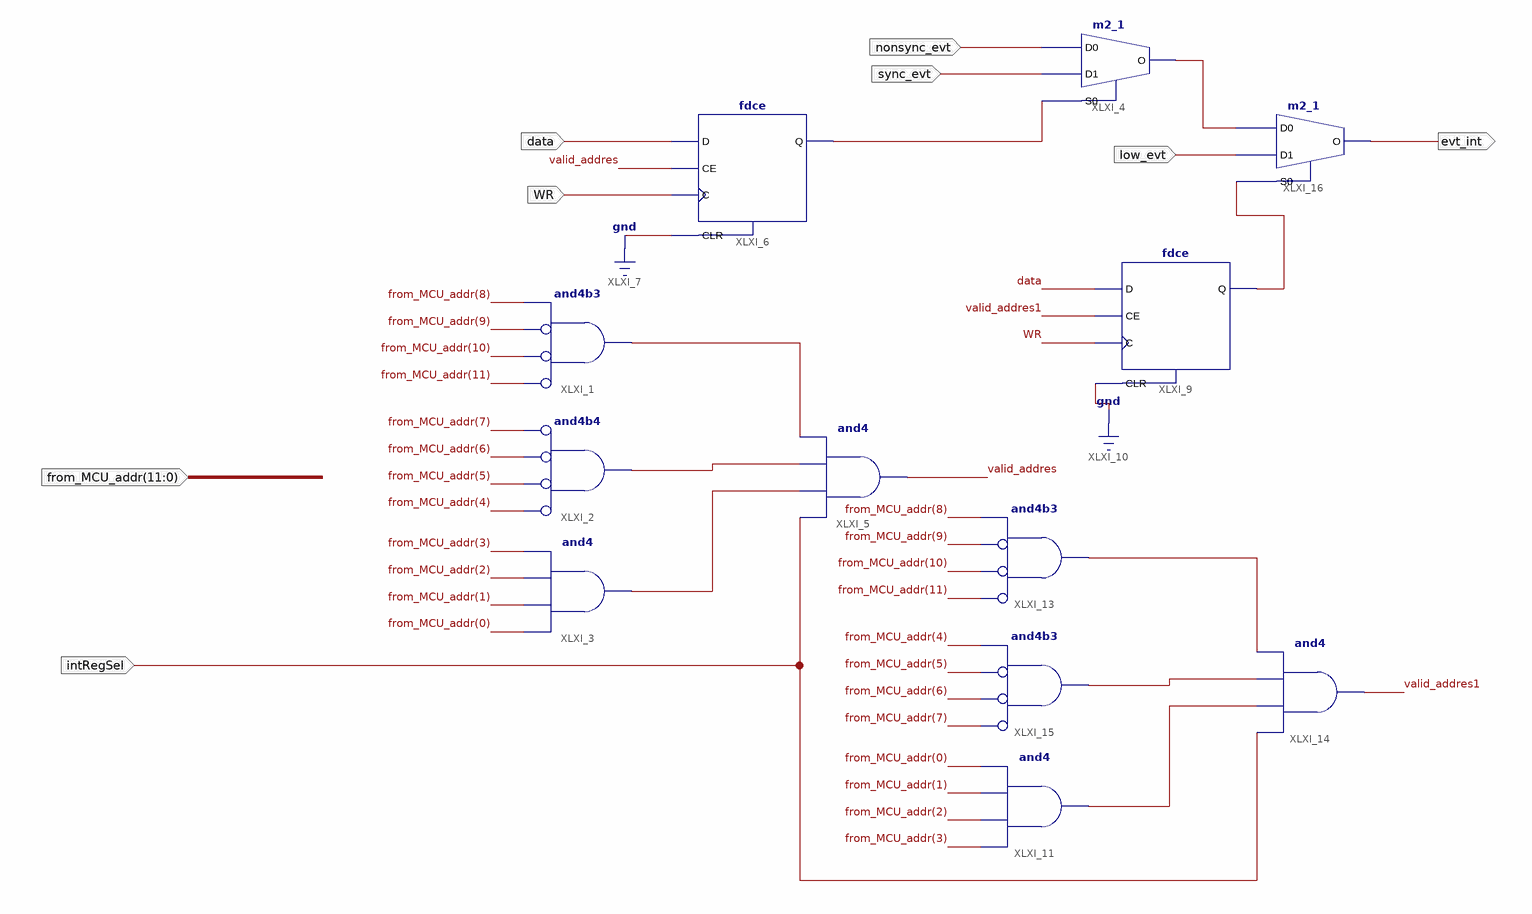
[diagram p0: schematic sheet 1]
// Xilinx ISE schematic event_control.sch (spartan6) as structural Verilog: 12 symbols, 8 ports
module event_control (
  input  nonsync_evt,
  input  sync_evt,
  input  [11:0] from_MCU_addr,
  input  WR,
  input  intRegSel,
  input  data,
  input  low_evt,
  output evt_int
);

  wire valid_addres, valid_addres1, XLXN_14, XLXN_15, XLXN_16, XLXN_21, XLXN_45, XLXN_46, XLXN_47, XLXN_53,
       XLXN_56;

  and XLXI_1 (XLXN_14, ~from_MCU_addr[11], ~from_MCU_addr[10], ~from_MCU_addr[9], from_MCU_addr[8]);  // and4b3
  and XLXI_2 (XLXN_15, ~from_MCU_addr[4], ~from_MCU_addr[5], ~from_MCU_addr[6], ~from_MCU_addr[7]);  // and4b4
  and XLXI_3 (XLXN_16, from_MCU_addr[0], from_MCU_addr[1], from_MCU_addr[2], from_MCU_addr[3]);
  m2_1 XLXI_4 (.D0(nonsync_evt), .D1(sync_evt), .S0(XLXN_21), .O(XLXN_56));
  and XLXI_5 (valid_addres, intRegSel, XLXN_16, XLXN_15, XLXN_14);
  fdce XLXI_6 (.C(WR), .CE(valid_addres), .CLR(1'b0), .D(data), .Q(XLXN_21));
  fdce XLXI_9 (.C(WR), .CE(valid_addres1), .CLR(1'b0), .D(data), .Q(XLXN_53));
  and XLXI_11 (XLXN_47, from_MCU_addr[3], from_MCU_addr[2], from_MCU_addr[1], from_MCU_addr[0]);
  and XLXI_13 (XLXN_45, ~from_MCU_addr[11], ~from_MCU_addr[10], ~from_MCU_addr[9], from_MCU_addr[8]);  // and4b3
  and XLXI_14 (valid_addres1, intRegSel, XLXN_47, XLXN_46, XLXN_45);
  and XLXI_15 (XLXN_46, ~from_MCU_addr[7], ~from_MCU_addr[6], ~from_MCU_addr[5], from_MCU_addr[4]);  // and4b3
  m2_1 XLXI_16 (.D0(XLXN_56), .D1(low_evt), .S0(XLXN_53), .O(evt_int));
endmodule
